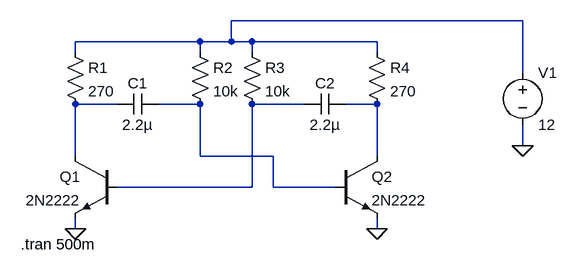
[diagram p0: schematic Lab_2.asc]
Lab_2.asc, the LTspice schematic file:
Version 4
SHEET 1 880 680
WIRE 640 -64 192 -64
WIRE 144 -32 -48 -32
WIRE 192 -32 192 -64
WIRE 192 -32 144 -32
WIRE 224 -32 192 -32
WIRE 416 -32 224 -32
WIRE -48 -16 -48 -32
WIRE 144 -16 144 -32
WIRE 224 -16 224 -32
WIRE 416 -16 416 -32
WIRE 640 16 640 -64
WIRE 16 64 -48 64
WIRE 144 64 80 64
WIRE 304 64 224 64
WIRE 416 64 368 64
WIRE 640 128 640 96
WIRE -48 144 -48 64
WIRE 144 144 144 64
WIRE 256 144 144 144
WIRE 416 144 416 64
WIRE 224 192 224 64
WIRE 224 192 16 192
WIRE 256 192 256 144
WIRE 352 192 256 192
WIRE -48 256 -48 240
WIRE 416 256 416 240
FLAG -48 256 0
FLAG 416 256 0
FLAG 640 128 0
SYMBOL npn 16 144 M0
SYMATTR InstName Q1
SYMATTR Value 2N2222
SYMBOL npn 352 144 R0
SYMATTR InstName Q2
SYMATTR Value 2N2222
SYMBOL res -64 -32 R0
SYMATTR InstName R1
SYMATTR Value 270
SYMBOL cap 80 48 R90
WINDOW 0 0 32 VBottom 2
WINDOW 3 32 32 VTop 2
SYMATTR InstName C1
SYMATTR Value 2.2µ
SYMBOL res 128 -32 R0
SYMATTR InstName R2
SYMATTR Value 10k
SYMBOL res 208 -32 R0
SYMATTR InstName R3
SYMATTR Value 10k
SYMBOL res 400 -32 R0
SYMATTR InstName R4
SYMATTR Value 270
SYMBOL cap 368 48 R90
WINDOW 0 0 32 VBottom 2
WINDOW 3 32 32 VTop 2
SYMATTR InstName C2
SYMATTR Value 2.2µ
SYMBOL voltage 640 0 R0
WINDOW 123 0 0 Left 0
WINDOW 39 0 0 Left 0
SYMATTR InstName V1
SYMATTR Value 12
TEXT -132 280 Left 2 !.tran 500m

The netlist it stands for:
* Lab_2.asc
Q1 N002 N004 0 0 2N2222
Q2 N005 N003 0 0 2N2222
R1 N001 N002 270
C1 N003 N002 2.2µ
R2 N001 N003 10k
R3 N001 N004 10k
R4 N001 N005 270
C2 N005 N004 2.2µ
V1 N001 0 12
.model NPN NPN
.model PNP PNP
.lib standard.bjt
.tran 500m
.backanno
.end